# EasyEDA Pro project U100.eprj

# Schematic Schematic1
Create Date: 2022-11-19; Page Name: P1; Project Name: U100; Schematic Name: Schematic1; Company: 嘉立创EDA; Page Size: A4; Version: V1.0
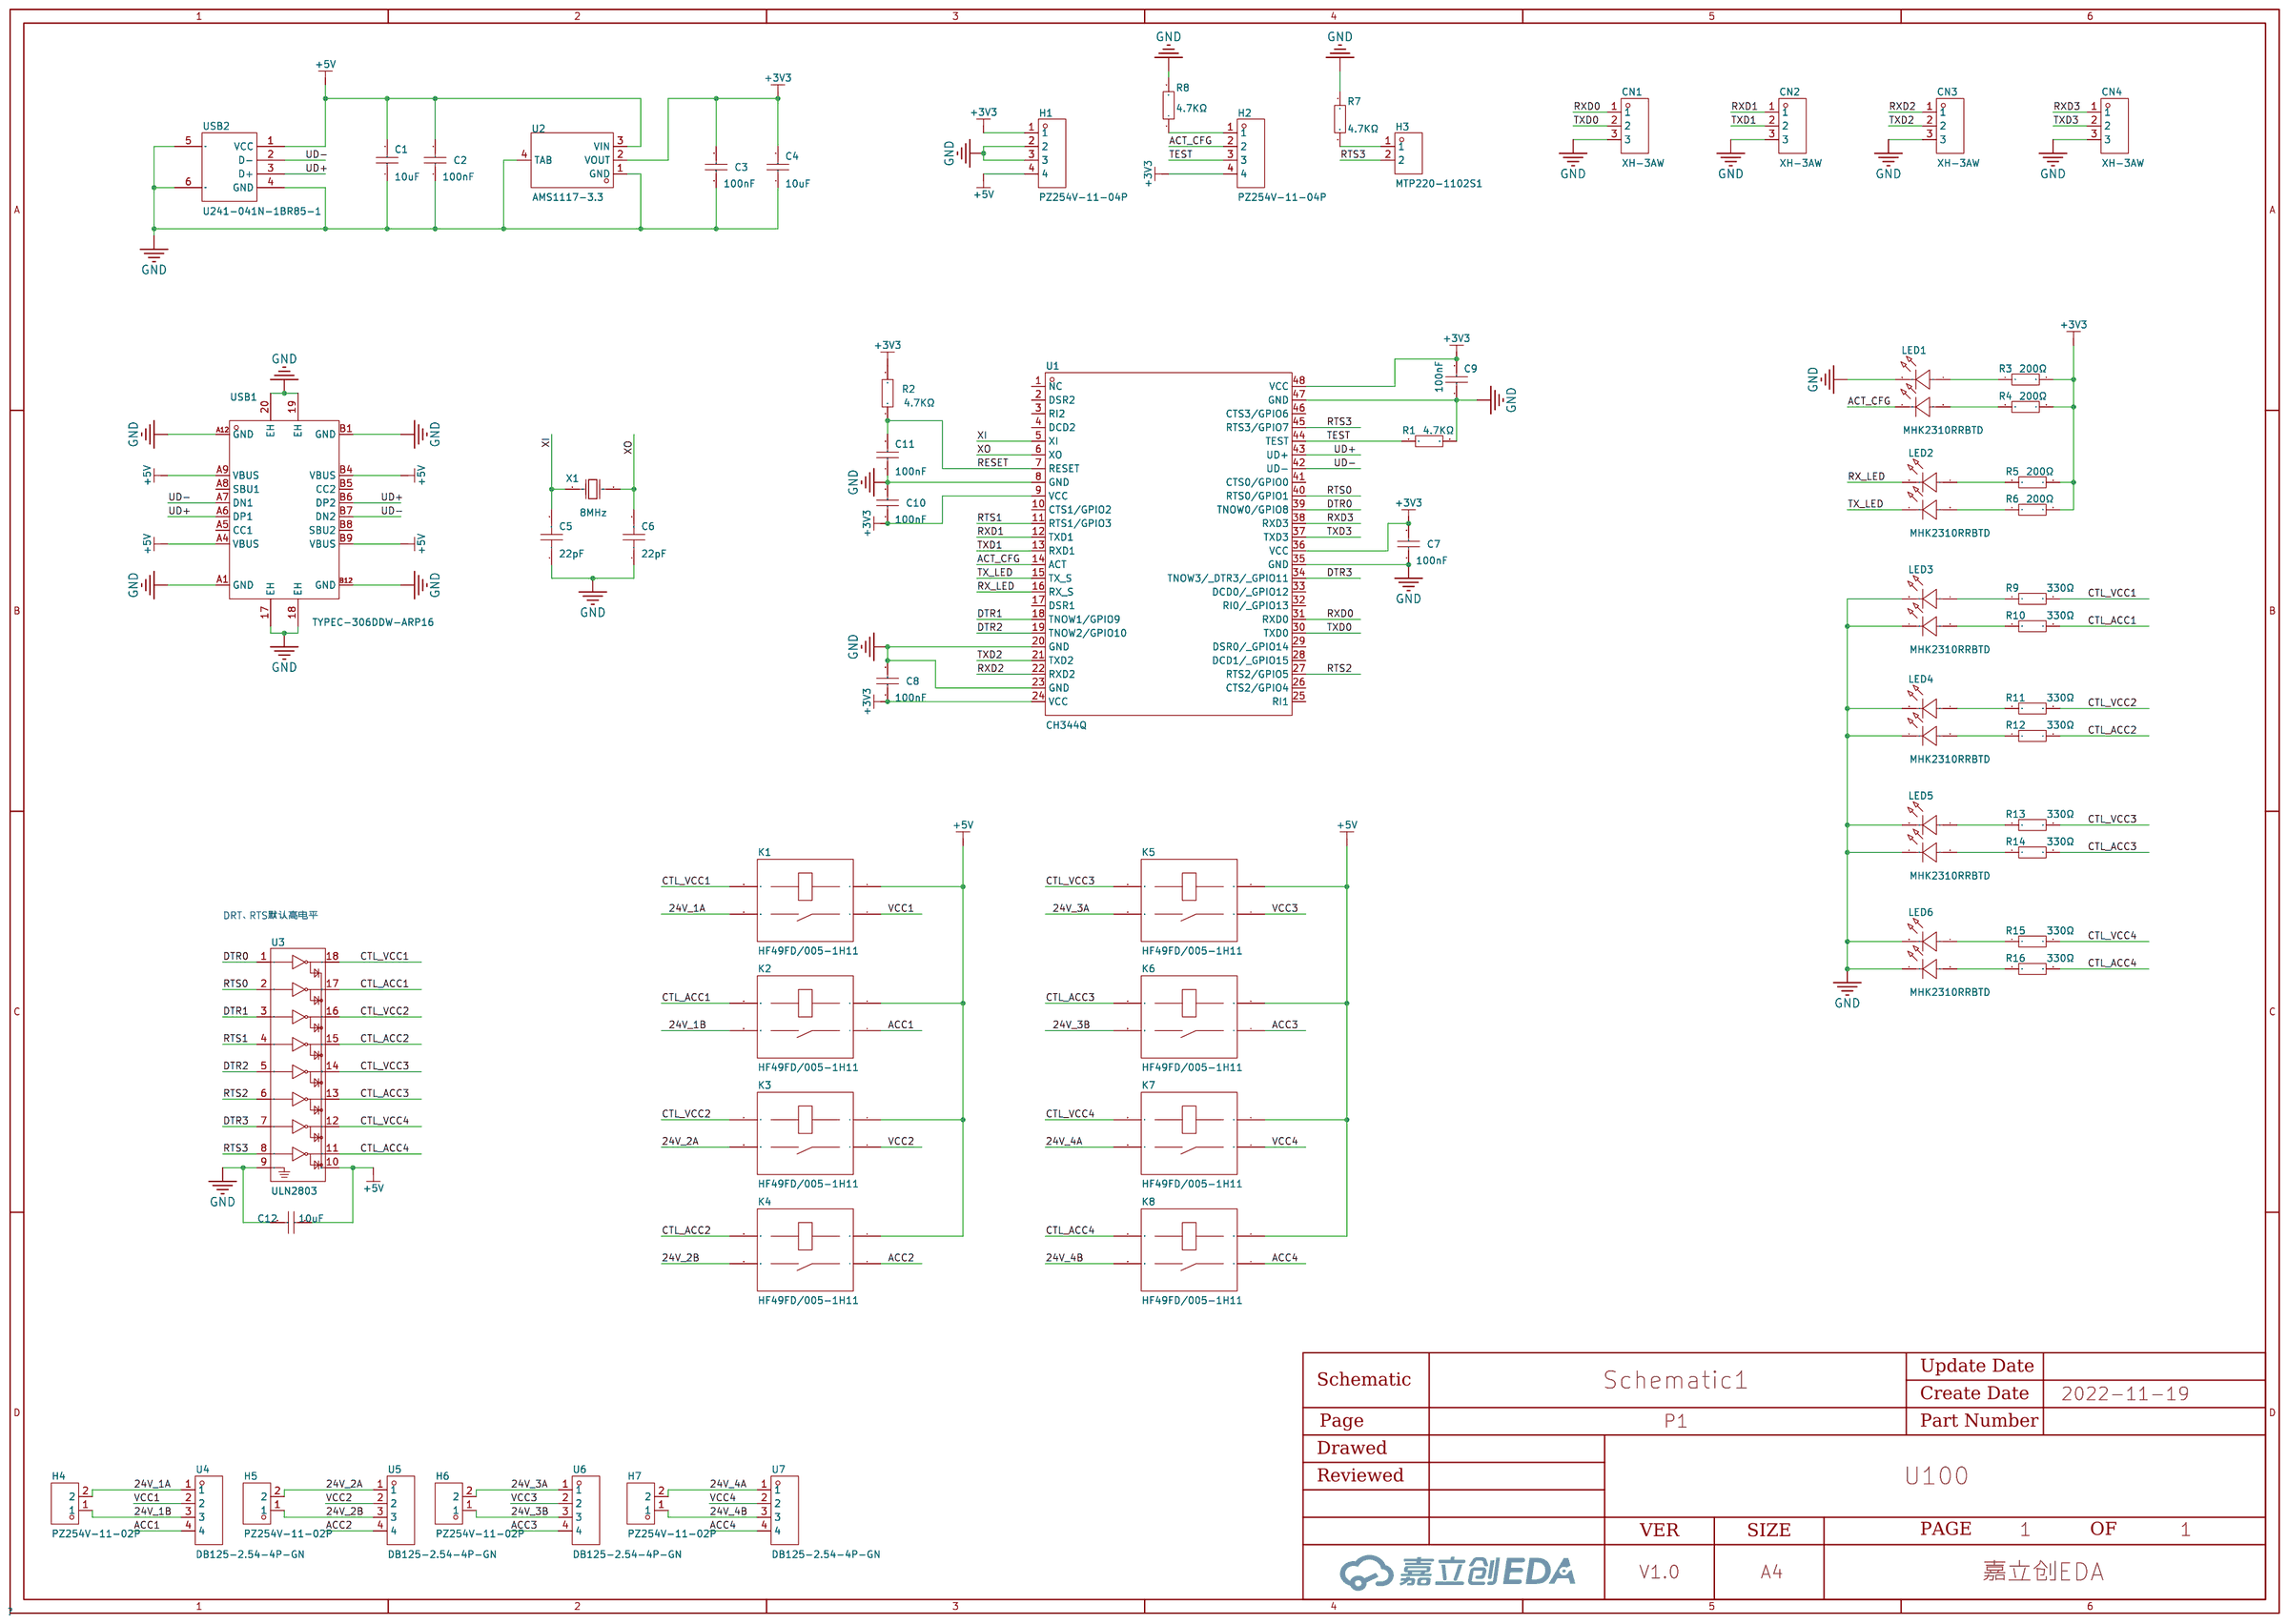
[diagram p0: schematic sheet]

## Parts
C1  10uF  [C0805]
C2  100nF  [C0805]
C3  100nF  [C0805]
C4  10uF  [C0805]
C5  22pF  [C0805]
C6  22pF  [C0805]
C7  100nF  [C0805]
C8  100nF  [C0805]
C9  100nF  [C0805]
C10  100nF  [C0805]
C11  100nF  [C0805]
C12  10uF  [C0805]
CN1  XH-3AW  [CONN-TH_3P-P2.54_HCTL_XH-3AW]
CN2  XH-3AW  [CONN-TH_3P-P2.54_HCTL_XH-3AW]
CN3  XH-3AW  [CONN-TH_3P-P2.54_HCTL_XH-3AW]
CN4  XH-3AW  [CONN-TH_3P-P2.54_HCTL_XH-3AW]
H1  PZ254V-11-04P  [HDR-TH_4P-P2.54-V-M]
H2  PZ254V-11-04P  [HDR-TH_4P-P2.54-V-M]
H3  MTP220-1102S1  [HDR-TH_2P-P2.00-V-M]
H4  PZ254V-11-02P  [HDR-TH_2P-P2.54-V-M]
H5  PZ254V-11-02P  [HDR-TH_2P-P2.54-V-M]
H6  PZ254V-11-02P  [HDR-TH_2P-P2.54-V-M]
H7  PZ254V-11-02P  [HDR-TH_2P-P2.54-V-M]
K1  HF49FD/005-1H11  [RELAY-TH_HF49FD-XXX-1H11-XXX]
K2  HF49FD/005-1H11  [RELAY-TH_HF49FD-XXX-1H11-XXX]
K3  HF49FD/005-1H11  [RELAY-TH_HF49FD-XXX-1H11-XXX]
K4  HF49FD/005-1H11  [RELAY-TH_HF49FD-XXX-1H11-XXX]
K5  HF49FD/005-1H11  [RELAY-TH_HF49FD-XXX-1H11-XXX]
K6  HF49FD/005-1H11  [RELAY-TH_HF49FD-XXX-1H11-XXX]
K7  HF49FD/005-1H11  [RELAY-TH_HF49FD-XXX-1H11-XXX]
K8  HF49FD/005-1H11  [RELAY-TH_HF49FD-XXX-1H11-XXX]
LED1  MHK2310RRBTD  [LED-TH_4P-P2.54_MHK2310RRBTD]
LED2  MHK2310RRBTD  [LED-TH_4P-P2.54_MHK2310RRBTD]
LED3  MHK2310RRBTD  [LED-TH_4P-P2.54_MHK2310RRBTD]
LED4  MHK2310RRBTD  [LED-TH_4P-P2.54_MHK2310RRBTD]
LED5  MHK2310RRBTD  [LED-TH_4P-P2.54_MHK2310RRBTD]
LED6  MHK2310RRBTD  [LED-TH_4P-P2.54_MHK2310RRBTD]
R1  4.7KΩ  [R0805]
R2  4.7KΩ  [R0805]
R3  200Ω  [R0805]
R4  200Ω  [R0805]
R5  200Ω  [R0805]
R6  200Ω  [R0805]
R7  4.7KΩ  [R0805]
R8  4.7KΩ  [R0805]
R9  330Ω  [R0805]
R10  330Ω  [R0805]
R11  330Ω  [R0805]
R12  330Ω  [R0805]
R13  330Ω  [R0805]
R14  330Ω  [R0805]
R15  330Ω  [R0805]
R16  330Ω  [R0805]
U1  CH344Q  [LQFP-48_L7.0-W7.0-P0.50-LS9.0-BL]
U2  AMS1117-3.3  [SOT-223-3_L6.5-W3.4-P2.30-LS7.0-BR]
U3  ULN2803  [SOP-18_L11.5-W7.5-P1.27-LS10.3-BL]
U4  DB125-2.54-4P-GN  [CONN-TH_DB125-2.54-4P-GN]
U5  DB125-2.54-4P-GN  [CONN-TH_DB125-2.54-4P-GN]
U6  DB125-2.54-4P-GN  [CONN-TH_DB125-2.54-4P-GN]
U7  DB125-2.54-4P-GN  [CONN-TH_DB125-2.54-4P-GN]
USB1  TYPEC-306DDW-ARP16  [USB-C-TH_TYPEC-306DDW-ARP16]
USB2  U241-041N-1BR85-1  [USB-B-TH_U241-041N-1BR85-1]
X1  8MHz  [OSC-TH_L10.0-W4.5-P5.00]

## Library data of the parts
C1-C4 C7-C12 = 0805B104K500NT: 温度系数:X7R;容值:100nF;精度:±10%;额定电压:50V;; LCSC Part Name: 100nF(104) ±10% 50V; Supplier Part: C38141; Manufacturer: FH(风华); Supplier Footprint: 0805; JLCPCB Part Class: Extended Part; Datasheet: https://atta.szlcsc.com/upload/public/pdf/source/20170923/C38141_1506149447419988747.pdf; Supplier: LCSC; Temperature Coefficient: X7R; Tolerance: ±10%; Voltage Rated: 50V
C5 C6 = 0805CG220J500NT: 温度系数:C0G;精度:±5%;额定电压:50V;容值:22pF;; LCSC Part Name: 22pF(220) ±5% 50V; Supplier Part: C24658; Manufacturer: FH(风华); Supplier Footprint: 0805; JLCPCB Part Class: Extended Part; Datasheet: https://atta.szlcsc.com/upload/public/pdf/source/20170923/C24658_1506149422956988697.pdf; Supplier: LCSC; Temperature Coefficient: C0G; Tolerance: ±5%; Voltage Rated: 50V
CN1-CN4 = XH-3AW: 参考系列:XH;间距:2.54mm;插针结构:1x3P;排数:1;每排PIN数:3;行距:-;公母:公型插针;安装方式:弯插;额定电流:3A;工作温度范围:-25℃~+85℃;; LCSC Part Name: 3P 2.54mm; Supplier Part: C2908612; Manufacturer: HCTL(华灿天禄); Supplier Footprint: 插件,P=2.54mm; JLCPCB Part Class: Extended Part; Datasheet: https://atta.szlcsc.com/upload/public/pdf/source/20211021/ACA2D54D99493880102FCACAC8DAABA8.pdf; Supplier: LCSC; Reference Series: XH; Pitch: 2.54mm; Pins Structure: 1x3P; Number of Rows: 1; Number of PINs Per Row: 3; Gender: 公型插针; Mounting Style: 弯插; Current Rating (Max): 3A; Operating Temperature Range: -25℃~+85℃
H1 H2 = PZ254V-11-04P: 间距:2.54mm;总PIN位数:4;排数:1;插针结构:1x4P;行距:-;安装类型:直插;圆针/方针:方针;额定电流:3A;额定电压:250V;配合针长度:6mm;塑高:2.5mm;端接针长度:3mm;触头材质:-;工作温度范围:-40℃~+105℃;颜色:黑色;; LCSC Part Name: 2.54mm 1x4P 直插 方针; Supplier Part: C2691448; Manufacturer: XFCN(兴飞); Supplier Footprint: 插件,P=2.54mm; JLCPCB Part Class: Extended Part; Datasheet: https://atta.szlcsc.com/upload/public/pdf/source/20200309/C492403_F9F19131791D08044AD4F84F8E751A34.pdf; Supplier: LCSC; Pitch: 2.54mm; Number of Pins: 4; Number of Rows: 1; Pin Structure: 1x4P; Mounting Type: 直插; Circluar Pins/Square Pins: 方针; Current Rating (Max): 3A; Voltage Rating (Max): 250V; Length of Mating Pin: 6mm; Insulation Height: 2.5mm; Length of End Connection Pin: 3mm; Operating Temperature Range: -40℃~+105℃; Color: 黑色
H3 = MTP220-1102S1: 间距:2mm;总PIN位数:2;排数:1;插针结构:1x2P;行距:-;安装类型:直插;圆针/方针:方针;额定电流:-;额定电压:-;配合针长度:4mm;塑高:2mm;端接针长度:2.8mm;触头材质:黄铜;触头镀层:-;工作温度范围:-40℃~+105℃;颜色:黑色;; LCSC Part Name: 2mm 1x2P 直插 方针; Supplier Part: C376075; Manufacturer: MINTRON(明硕); Supplier Footprint: 插件,P=2mm; JLCPCB Part Class: Extended Part; Datasheet: https://atta.szlcsc.com/upload/public/pdf/source/20190320/C376075_C9D946476DF37AE707CF4A5E7AD237C9.pdf; Supplier: LCSC; Pitch: 2mm; Number of Pins: 2; Number of Rows: 1; Pin Structure: 1x2P; Mounting Type: 直插; Circluar Pins/Square Pins: 方针; Length of Mating Pin: 4mm; Insulation Height: 2mm; Length of End Connection Pin: 2.8mm; Contact Material: 黄铜; Operating Temperature Range: -40℃~+105℃; Color: 黑色
H4-H7 = PZ254V-11-02P: 间距:2.54mm;总PIN位数:2;排数:1;插针结构:1x2P;行距:-;安装类型:直插;圆针/方针:方针;额定电流:-;额定电压:-;配合针长度:6mm;塑高:2.5mm;端接针长度:3mm;触头材质:黄铜;触头镀层:-;工作温度范围:-40℃~+105℃;颜色:黑色;; LCSC Part Name: 2.54mm 1x2P 直插 方针; Supplier Part: C492401; Manufacturer: XFCN(兴飞); Supplier Footprint: 插件,P=2.54mm; JLCPCB Part Class: Extended Part; Datasheet: https://atta.szlcsc.com/upload/public/pdf/source/20200309/C492401_A812433581A9B211A7FFA413ADDFF0E5.pdf; Supplier: LCSC; Pitch: 2.54mm; Number of Pins: 2; Number of Rows: 1; Pin Structure: 1x2P; Mounting Type: 直插; Circluar Pins/Square Pins: 方针; Length of Mating Pin: 6mm; Insulation Height: 2.5mm; Length of End Connection Pin: 3mm; Contact Material: 黄铜; Operating Temperature Range: -40℃~+105℃; Color: 黑色
K1-K8 = HF49FD/005-1H11: 线圈电压:5V;线圈类型:非极化-单线圈;触点形式:一组常开:1A(单刀单掷-常开);最大切换电流:5A;; Supplier Part: C28975; Manufacturer: HF(宏发); Supplier Footprint: SIP-4; JLCPCB Part Class: Extended Part; Datasheet: https://atta.szlcsc.com/upload/public/pdf/source/20141025/1457707244162.pdf; Supplier: LCSC; Coil Voltage: 5V; Coil Type: 非极化-单线圈; Pin Number: 4; Contact Form: 一组常开:1A(单刀单掷-常开); Maximum Switching Current: 5A; Maximum Switching Voltage: 250V@AC；30V@DC; Coil Rated Power: 120mW; Contact Rating: 5A@30VDC；5A@250VAC; Coil Resistance: 208Ω; Operate Time: 10ms; Release Time: 5ms; Contact Resistance: 100mΩ; Contact Material: AgNi; Operating Temperature: -40℃~+85℃
LED1-LED6 = MHK2310RRBTD: 发光颜色:红灯;二极管配置:-;透镜颜色:雾状红;主波长:700nm;峰值波长:-;色温:-;测试电流:20mA;功率:78mW;发光角度:80°;安装方式:-;工作温度:-25℃~+85℃;; LCSC Part Name: 红灯 700nm LED货套双LED; Supplier Part: C2764897; Manufacturer: MEIHUA(美华); Supplier Footprint: 直插,P=2.54mm; JLCPCB Part Class: Extended Part; Datasheet: https://atta.szlcsc.com/upload/public/pdf/source/20220527/CE68B426C791C0435B1D4886CD02D3DC.pdf; Supplier: LCSC; Emitted Color: 红灯; Lens Color: 雾状红; Dominant Wavelength: 700nm; Forward Current: 20mA; Power Dissipation: 78mW; Viewing Angle: 80°; Operating Temperature: -25℃~+85℃; Lamp Holder Type: 组装式圆形灯头
R1-R7 R9-R16 = 0805W8F0000T5E: 精度:±1%;温度系数:±800ppm/℃;阻值:0Ω;功率:0.125W;; LCSC Part Name: 0Ω ±1%; Supplier Part: C17477; Manufacturer: UNI-ROYAL(厚声); Supplier Footprint: 0805; JLCPCB Part Class: Basic Part; Datasheet: https://atta.szlcsc.com/upload/public/pdf/source/20170920/C17477_1505887096936979836.pdf; Supplier: LCSC; Tolerance: ±1%; Temperature Coefficient: ±800ppm/℃; Power(Watts): 0.125W
R8 = 0805W8F0000T5E: 精度:±1%;温度系数:±800ppm/℃;阻值:0Ω;功率:0.125W;; LCSC Part Name: 4.7KΩ ±1%; Supplier Part: C17477; Manufacturer: UNI-ROYAL(厚声); Supplier Footprint: 0805; JLCPCB Part Class: Basic Part; Datasheet: https://atta.szlcsc.com/upload/public/pdf/source/20170920/C17477_1505887096936979836.pdf; Supplier: LCSC; Tolerance: ±1%; Temperature Coefficient: ±800ppm/℃; Power(Watts): 0.125W
U1 = CH344Q: USB转四路异步串口,波特率支持高达230400bps,提供4路RS485方向控制引脚,12GPIO等信号; Supplier Part: C2988084; Manufacturer: WCH(南京沁恒); Supplier Footprint: LQFP-48; JLCPCB Part Class: Extended Part; Datasheet: https://atta.szlcsc.com/upload/public/pdf/source/20220418/AB154A0A58B20703C58BC5378F7BDD74.pdf; Supplier: LCSC
U2 = AMS1117-3.3_C351784: 输出类型:固定;输出极性:正;输出通道数:1;最大输入电压:18V;输出电压:3.3V;压差:1.4V@(1A);输出电流:800mA;电源纹波抑制比(PRSS):-;; LCSC Part Name: Vin=18V Vout=3.3V 800mA; Supplier Part: C351784; Manufacturer: PUOLOP(迪浦); Supplier Footprint: SOT-223; JLCPCB Part Class: Extended Part; Datasheet: https://atta.szlcsc.com/upload/public/pdf/source/20210915/EA806799CEEC3F52E0A4FA8303A508AC.pdf; Supplier: LCSC; Output Type: 固定; Output Polarity: 正; Number of Outputs: 1; Maximum Input Voltage: 18V; Output Voltage: 3.3V; Dropout Voltage: 1.4V@(1A); Output Current: 800mA
U3 = ULN2803_C504564: 开态输入电压(VI(on)@Vce,Ic):3V@2V,300mA;集射极饱和压降(VCE(sat)@Ii,Ic):0.85V@250A,100mA;输出漏电流(Icex@Vce):50A@40V;开态输入电流(Ii@Vi):0.93mA@3.85V;关态输入电流(Ii(off)@Vce,Ic):100A@500mA;嵌位二极管漏电流(IR@VR):50A@40V;嵌位二极管正向压降(VF@IF):1.5V@350mA;输入电容(Ci):15pF;工作温度:0℃~+70℃;; Supplier Part: C504564; Manufacturer: Gcore(扬州国芯); Supplier Footprint: SOP-18; JLCPCB Part Class: Extended Part; Datasheet: https://atta.szlcsc.com/upload/public/pdf/source/20200327/C504564_30BE622D4B2BD79BF189CC2BD56DB9B3.pdf; Supplier: LCSC; ON-state input   voltage(VI(on)@Vce,Ic): 3V@2V,300mA; Collector-emitter   saturation voltage (VCE(sat)@Ii,Ic): 0.85V@250A,100mA; Output leakage current (Icex@Vce): 50A@40V; Input current (Ii@Vi): 0.93mA@3.85V; Off-state input current (Ii(off)@Vce,Ic): 100A@500mA; Clamp Diode Leakage Current (IR@VR): 50A@40V; Clamp Diode Forward Voltage (VF@IF): 1.5V@350mA; Input Capacitance (Ci): 15pF; Operating Temperature: 0℃~+70℃
U4-U7 = DB125-2.54-4P-GN: 间距:2.54mm;排数:1;每排PIN数:4;安装方式:直针;额定电流:8A;额定电压:130V;线规 - AWG:18~26;线规 - mm²:0.5~1;工作温度范围:-40℃~+105℃;颜色:绿色;; LCSC Part Name: 2.54mm 排数:1 每排P数:4 直针; Supplier Part: C918122; Manufacturer: DIBO(地博电气); Supplier Footprint: 直插,P=2.54mm; JLCPCB Part Class: Extended Part; Datasheet: https://atta.szlcsc.com/upload/public/pdf/source/20201111/C918120_C9DB7F6F3DB366529A80D61CABEEDAE6.pdf; Supplier: LCSC; Pitch: 2.54mm; Number of Rows: 1; Number of PINs Per Row: 4; Mounting Style: 直针; Current Rating (Max): 8A; Voltage Rating (Max): 130V; Wire Gauge - AWG: 18~26; Wire Gauge - mm?: 0.5~1; Operating Temperature Range: -40℃~+105℃; Color: 绿色
USB1 = TYPEC-306DDW-ARP16: 连接器类型:Type-C;标准:USB 3.1;公母:母座;触点数量:16;端口数量:1;安装方式:弯插;额定电流 - 电源:5A;触头材质:-;触头镀层:-;工作温度范围:-45℃~+85℃;焊接温度(最大值):260℃;; LCSC Part Name: Type-C 母座 弯插; Supplier Part: C2840393; Manufacturer: XUNPU(讯普); Supplier Footprint: 插件; JLCPCB Part Class: Extended Part; Datasheet: https://atta.szlcsc.com/upload/public/pdf/source/20210817/197D5097245422051F6928F5184DB483.pdf; Supplier: LCSC; Connector Type: Type-C; Standard: USB 3.1; Gender: 母座; Number of Contacts: 16; Number of Ports: 1; Mounting Style: 弯插; Current Rating - Power (Max): 5A; Operating Temperature Range: -45℃~+85℃; Welding Temperature (Max): 260℃
USB2 = U241-041N-1BR85-1: 连接器类型:Type-B;标准:USB 2.0;公母:母座;触点数量:4;端口数量:1;安装方式:弯插;额定电流 - 电源:2A;触头材质:黄铜;触头镀层:金;工作温度范围:-40℃~+85℃;焊接温度(最大值):235℃;; LCSC Part Name: Type-B 母座 弯插; Supplier Part: C397338; Manufacturer: XKB Connectivity(中国星坤); Supplier Footprint: 插件; JLCPCB Part Class: Extended Part; Datasheet: https://atta.szlcsc.com/upload/public/pdf/source/20211011/96CE344EA33EF85845E438A5758B100B.pdf; Supplier: LCSC; Connector Type: Type-B; Standard: USB 2.0; Gender: 母座; Number of Contacts: 4; Number of Ports: 1; Mounting Style: 弯插; Current Rating - Power (Max): 2A; Contact Material: 黄铜; Contact Plating: 金; Operating Temperature Range: -40℃~+85℃; Welding Temperature (Max): 235℃
X1 = X49SD8MSD2SC: 晶振类型:49S晶振;频率:8MHz;频率公差:±20ppm;频率稳定度:±30ppm;负载电容:20pF;工作温度:-20℃~+70℃;; LCSC Part Name: HC-49US 8MHz ±20ppm 20pF; Supplier Part: C21263; Manufacturer: YXC(扬兴晶振); Supplier Footprint: HC-49S-2P; JLCPCB Part Class: Extended Part; Datasheet: https://atta.szlcsc.com/upload/public/pdf/source/20210903/A997D130AE99CBB55D9024F9BE6DA174.pdf; Supplier: LCSC; Crystal Type: 49S晶振; Frequency Tolerance: ±20ppm; Frequency Stability: ±30ppm; Load Capacitance: 20pF; Operating Temperature: -20℃~+70℃

## Nets
24V_1A: H4.2 K1.3 U4.1
24V_1B: H4.1 K2.3 U4.3
24V_2A: H5.2 K3.3 U5.1
24V_2B: H5.1 K4.3 U5.3
24V_3A: H6.2 K5.3 U6.1
24V_3B: H6.1 K6.3 U6.3
24V_4A: H7.2 K7.3 U7.1
24V_4B: H7.1 K8.3 U7.3
+3V3: C3.2 C4.2 C7.2 C8.1 C9.2 C10.1 H1.1 H2.4 R2.2 R3.2 R4.2 R5.2 R6.2 U1.9(VCC) U1.24(VCC) U1.36(VCC) U1.48(VCC) U2.2(VOUT)
+5V: C1.2 C2.2 C12.1 H1.4 K1.1 K2.1 K3.1 K4.1 K5.1 K6.1 K7.1 K8.1 U2.3(VIN) U3.10(COMMON) USB1.A4(VBUS) USB1.A9(VBUS) USB1.B4(VBUS) USB1.B9(VBUS) USB2.1(VCC)
GND: C1.1 C2.1 C3.1 C4.1 C5.1 C6.1 C7.1 C8.2 C9.1 C10.2 C11.1 C12.2 CN1.3 CN2.3 CN3.3 CN4.3 H1.2 H1.3 LED1.3(K) LED3.1(K) LED3.3(K) LED4.1(K) LED4.3(K) LED5.1(K) LED5.3(K) LED6.1(K) LED6.3(K) R1.2 R7.1 R8.2 U1.8(GND) U1.20(GND) U1.23(GND) U1.35(GND) U1.47(GND) U2.1(GND) U2.4(TAB) U3.9(GND) USB1.17(EH) USB1.18(EH) USB1.19(EH) USB1.20(EH) USB1.A1(GND) USB1.A12(GND) USB1.B1(GND) USB1.B12(GND) USB2.4(GND) USB2.5(SH1) USB2.6(SH2)
VCC1: K1.4 U4.2
VCC2: K3.4 U5.2
VCC3: K5.4 U6.2
VCC4: K7.4 U7.2
ACC1: K2.4 U4.4
ACC2: K4.4 U5.4
ACC3: K6.4 U6.4
ACC4: K8.4 U7.4
ACT_CFG: H2.2 LED1.1(K) U1.14(ACT)
CTL_ACC1: K2.2 R10.2 U3.17(O2)
CTL_ACC2: K4.2 R12.2 U3.15(O4)
CTL_ACC3: K6.2 R14.2 U3.13(O6)
CTL_ACC4: K8.2 R16.2 U3.11(O8)
CTL_VCC1: K1.2 R9.2 U3.18(O1)
CTL_VCC2: K3.2 R11.2 U3.16(O3)
CTL_VCC3: K5.2 R13.2 U3.14(O5)
CTL_VCC4: K7.2 R15.2 U3.12(O7)
DTR0: U1.39(TNOW0/GPIO8) U3.1(I1)
DTR1: U1.18(TNOW1/GPIO9) U3.3(I3)
DTR2: U1.19(TNOW2/GPIO10) U3.5(I5)
DTR3: U1.34(TNOW3/ DTR3/ GPIO11) U3.7(I7)
RESET: C11.2 R2.1 U1.7(RESET)
RTS0: U1.40(RTS0/GPIO1) U3.2(I2)
RTS1: U1.11(RTS1/GPIO3) U3.4(I4)
RTS2: U1.27(RTS2/GPIO5) U3.6(I6)
RTS3: H3.2 U1.45(RTS3/GPIO7) U3.8(I8)
RX_LED: LED2.3(K) U1.16(RX_S)
RXD0: CN1.1 U1.31(RXD0)
RXD1: CN2.1 U1.12(TXD1)
RXD2: CN3.1 U1.22(RXD2)
RXD3: CN4.1 U1.38(RXD3)
TEST: H2.3 R1.1 U1.44(TEST)
TX_LED: LED2.1(K) U1.15(TX_S)
TXD0: CN1.2 U1.30(TXD0)
TXD1: CN2.2 U1.13(RXD1)
TXD2: CN3.2 U1.21(TXD2)
TXD3: CN4.2 U1.37(TXD3)
UD+: U1.43(UD+) USB1.A6(DP1) USB1.B6(DP2) USB2.3(D+)
UD-: U1.42(UD-) USB1.A7(DN1) USB1.B7(DN2) USB2.2(D-)
XI: C5.2 U1.5(XI) X1.1(OSC1)
XO: C6.2 U1.6(XO) X1.2(OSC2)
$1N13413: LED1.4(A) R3.1
$1N13442: LED1.2(A) R4.1
$1N14121: LED2.4(A) R5.1
$1N14153: LED2.2(A) R6.1
$1N14923: H2.1 R8.1
$1N15051: H3.1 R7.2
$1N34229: LED3.4(A) R9.1
$1N34270: LED3.2(A) R10.1
$1N34311: LED4.4(A) R11.1
$1N34352: LED4.2(A) R12.1
$1N34393: LED5.4(A) R13.1
$1N34434: LED5.2(A) R14.1
$1N34475: LED6.4(A) R15.1
$1N34516: LED6.2(A) R16.1

Not connected (* = marked no-connect by the designer): U1 1(NC) 2(DSR2) 3(RI2) 4(DCD2) 10(CTS1/GPIO2) 17(DSR1) 25(RI1) 26(CTS2/GPIO4) 28(DCD1/ GPIO15) 29(DSR0/ GPIO14) 32(RI0/ GPIO13) 33(DCD0/ GPIO12) 41(CTS0/GPIO0) 46(CTS3/GPIO6); USB1 A5(CC1) A8(SBU1) B5(CC2) B8(SBU2)

## Notes on the sheet
- DRT、RTS默认高电平

# Board PCB1
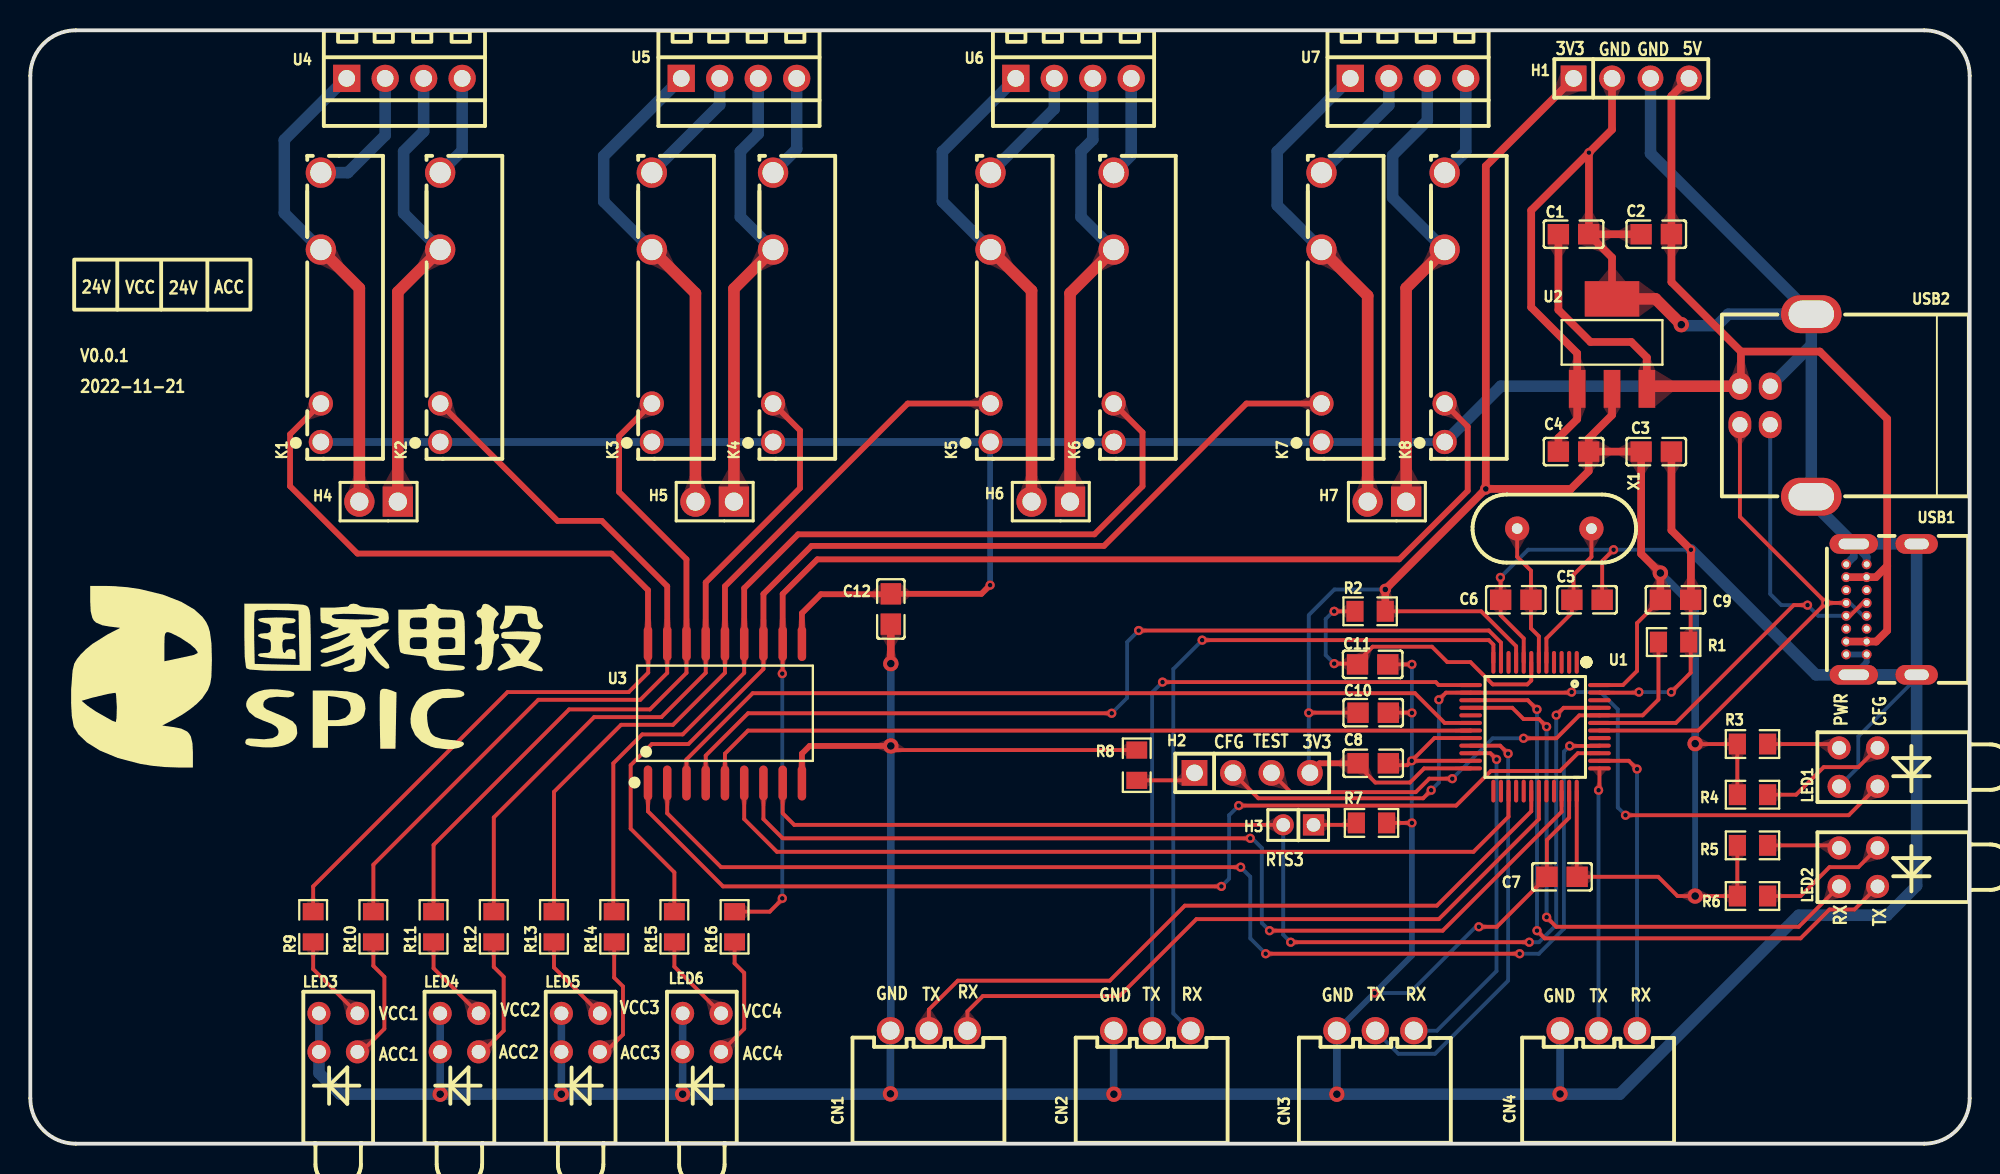
[diagram p1: board, top side]
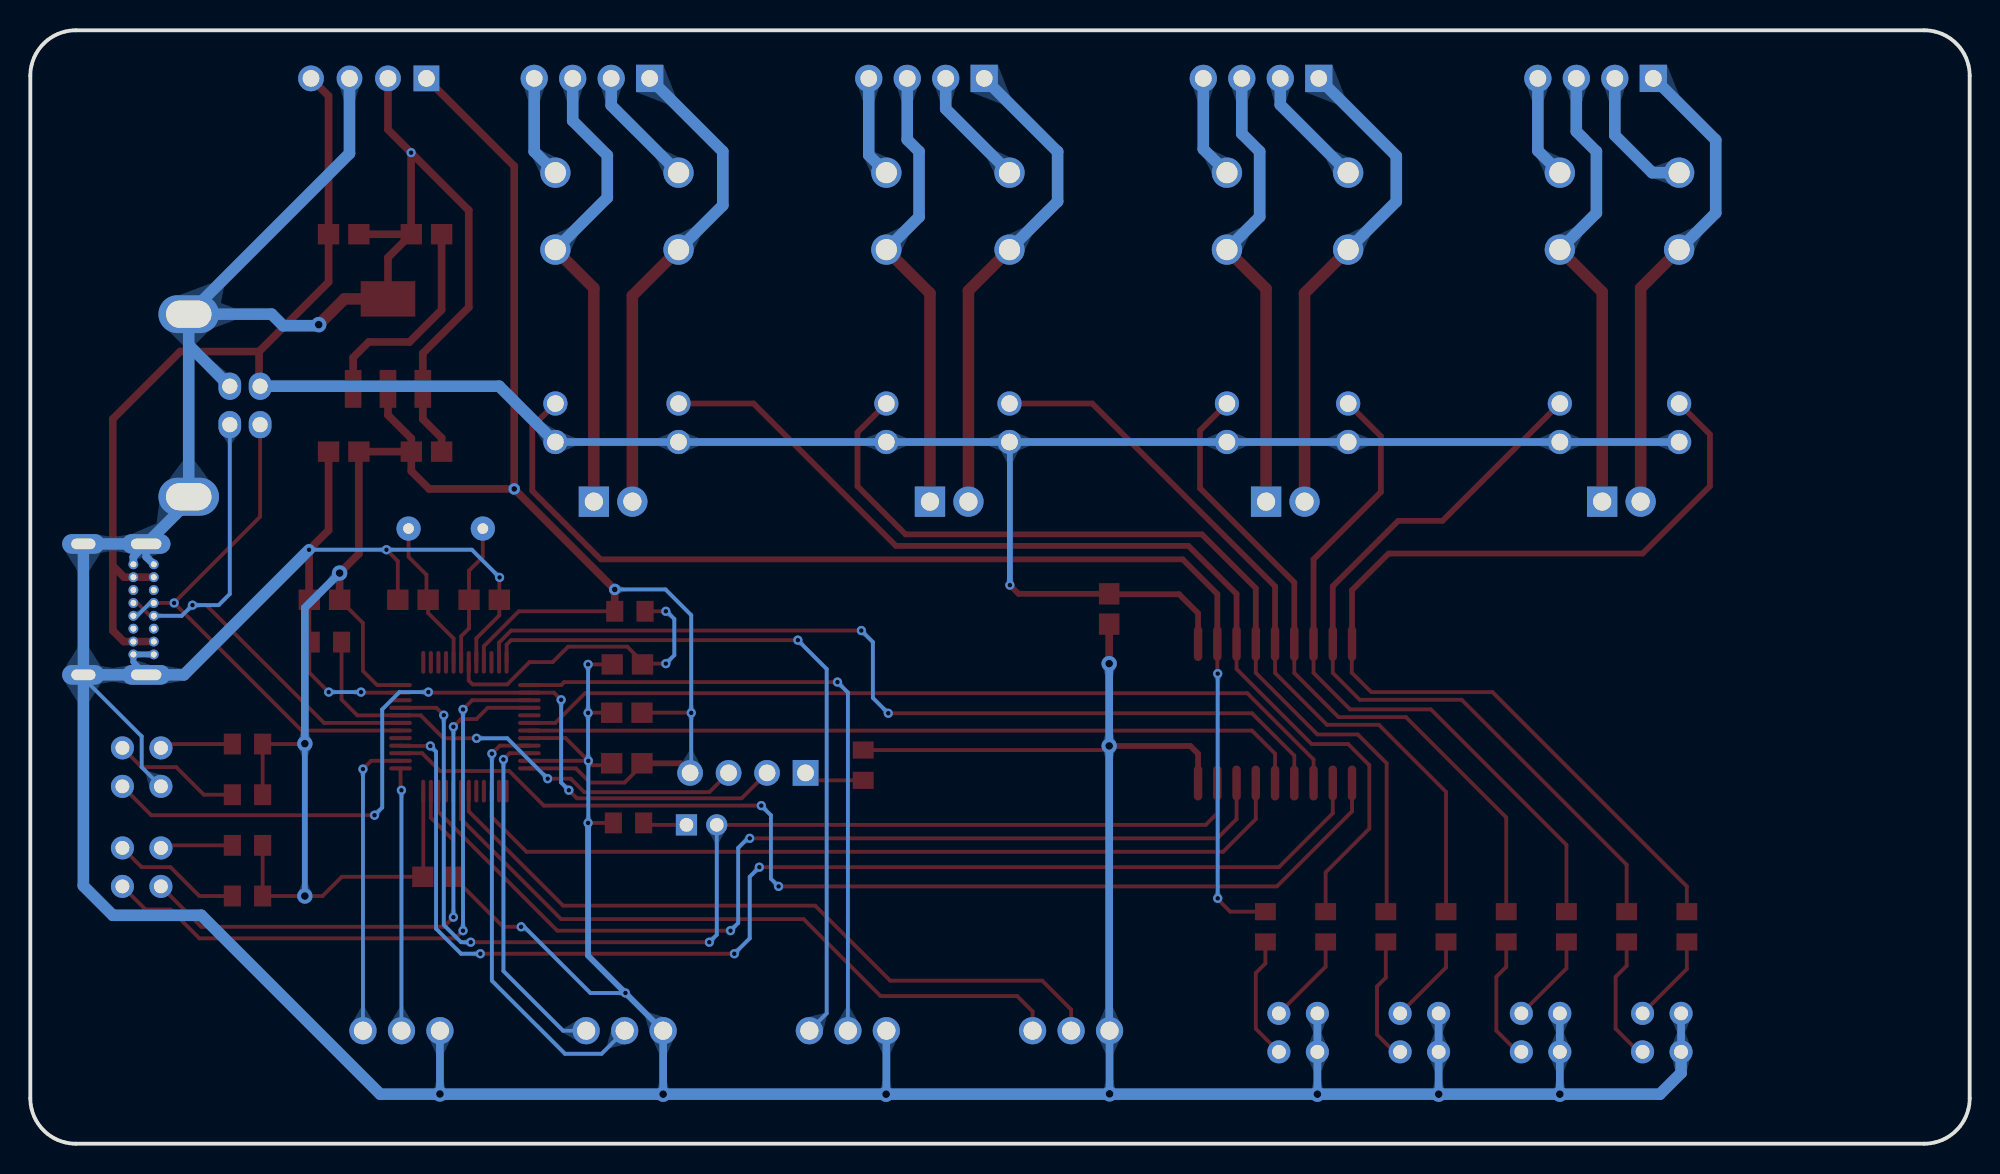
[diagram p2: board, bottom side, seen from below]

Outline 128 x 73.5 mm; copper layers: Top Layer, Bottom Layer. Coordinates in mm from the lower left corner of the outline.
Outline path: 0,70.5 0,3 arc(0.88,0.88) 3,0 125,0 arc(127.12,0.88) 128,3 128,70.5 arc(127.12,72.62) 125,73.5 3,73.5 arc(0.88,72.62) 0,70.5
Stack: Top Layer 0.035mm / Dielectric1 1.51mm FR4 er 4.5 / Bottom Layer 0.035mm

## Design rules (mm)
net UD+: DP1
net UD-: DP1
spacing safeClearance (default): track to track 0.152, other pairs 0.152 to 0.3
track width trackWidth (default): min 0.127, default 0.254, max 2.54
differential pair differentialPair (default): width min 0.127, default 0.254, max 2.54; gap min 0.152, default 0.152
via viaSize (default): diameter min 0.5, default 0.61, max 10; hole min 0.3, default 0.305, max 6

## Placement (name value [footprint] x y rotation side)
C1  10uF  [C0805]  101.85 60.04 180 top
C2  100nF  [C0805]  107.31 60.04 0 top
C3  100nF  [C0805]  107.31 45.69 180 top
C4  10uF  [C0805]  101.85 45.69 0 top
C5  22pF  [C0805]  102.74 35.91 180 top
C6  22pF  [C0805]  98.04 35.91 0 top
C7  100nF  [C0805]  101.09 17.62 0 top
C8  100nF  [C0805]  88.63 25.11 0 top
C9  100nF  [C0805]  108.59 35.91 180 top
C10  100nF  [C0805]  88.63 28.45 0 top
C11  100nF  [C0805]  88.59 31.64 180 top
C12  10uF  [C0805]  56.79 35.3 270 top
CN1  XH-3AW  [CONN-TH_3P-P2.54_HCTL_XH-3AW]  59.31 7.46 180 top
CN2  XH-3AW  [CONN-TH_3P-P2.54_HCTL_XH-3AW]  74.04 7.46 180 top
CN3  XH-3AW  [CONN-TH_3P-P2.54_HCTL_XH-3AW]  88.77 7.46 180 top
CN4  XH-3AW  [CONN-TH_3P-P2.54_HCTL_XH-3AW]  103.5 7.46 180 top
H1  PZ254V-11-04P  [HDR-TH_4P-P2.54-V-M]  105.66 70.33 0 top
H2  PZ254V-11-04P  [HDR-TH_4P-P2.54-V-M]  80.65 24.48 0 top
H3  MTP220-1102S1  [HDR-TH_2P-P2.00-V-M]  83.69 21.05 180 top
H4  PZ254V-11-02P  [HDR-TH_2P-P2.54-V-M]  22.99 42.39 180 top
H5  PZ254V-11-02P  [HDR-TH_2P-P2.54-V-M]  45.17 42.39 180 top
H6  PZ254V-11-02P  [HDR-TH_2P-P2.54-V-M]  67.35 42.39 180 top
H7  PZ254V-11-02P  [HDR-TH_2P-P2.54-V-M]  89.53 42.39 180 top
K1  HF49FD/005-1H11  [RELAY-TH_HF49FD-XXX-1H11-XXX]  19.18 55.21 90 top
K2  HF49FD/005-1H11  [RELAY-TH_HF49FD-XXX-1H11-XXX]  27.05 55.21 90 top
K3  HF49FD/005-1H11  [RELAY-TH_HF49FD-XXX-1H11-XXX]  41.02 55.21 90 top
K4  HF49FD/005-1H11  [RELAY-TH_HF49FD-XXX-1H11-XXX]  49.02 55.21 90 top
K5  HF49FD/005-1H11  [RELAY-TH_HF49FD-XXX-1H11-XXX]  63.37 55.21 90 top
K6  HF49FD/005-1H11  [RELAY-TH_HF49FD-XXX-1H11-XXX]  71.5 55.21 90 top
K7  HF49FD/005-1H11  [RELAY-TH_HF49FD-XXX-1H11-XXX]  85.22 55.21 90 top
K8  HF49FD/005-1H11  [RELAY-TH_HF49FD-XXX-1H11-XXX]  93.34 55.21 90 top
LED1  MHK2310RRBTD  [LED-TH_4P-P2.54_MHK2310RRBTD]  120.65 24.86 90 top
LED2  MHK2310RRBTD  [LED-TH_4P-P2.54_MHK2310RRBTD]  120.65 18.25 90 top
LED3  MHK2310RRBTD  [LED-TH_4P-P2.54_MHK2310RRBTD]  20.32 7.33 0 top
LED4  MHK2310RRBTD  [LED-TH_4P-P2.54_MHK2310RRBTD]  28.32 7.33 0 top
LED5  MHK2310RRBTD  [LED-TH_4P-P2.54_MHK2310RRBTD]  36.32 7.33 0 top
LED6  MHK2310RRBTD  [LED-TH_4P-P2.54_MHK2310RRBTD]  44.32 7.33 0 top
R1  4.7KΩ  [R0805]  108.46 33.11 0 top
R2  4.7KΩ  [R0805]  88.43 35.15 0 top
R3  200Ω  [R0805]  113.66 26.38 180 top
R4  200Ω  [R0805]  113.66 23.04 180 top
R5  200Ω  [R0805]  113.66 19.69 180 top
R6  200Ω  [R0805]  113.66 16.35 180 top
R7  4.7KΩ  [R0805]  88.52 21.18 180 top
R8  4.7KΩ  [R0805]  73.03 24.99 90 top
R9  330Ω  [R0805]  18.67 14.32 90 top
R10  330Ω  [R0805]  22.64 14.32 90 top
R11  330Ω  [R0805]  26.62 14.32 90 top
R12  330Ω  [R0805]  30.59 14.32 90 top
R13  330Ω  [R0805]  34.56 14.32 90 top
R14  330Ω  [R0805]  38.54 14.32 90 top
R15  330Ω  [R0805]  42.51 14.32 90 top
R16  330Ω  [R0805]  46.48 14.32 90 top
U1  CH344Q  [LQFP-48_L7.0-W7.0-P0.50-LS9.0-BL]  99.31 27.53 180 top
U2  AMS1117-3.3  [SOT-223-3_L6.5-W3.4-P2.30-LS7.0-BR]  104.39 52.8 270 top
U3  ULN2803  [SOP-18_L11.5-W7.5-P1.27-LS10.3-BL]  45.85 28.42 0 top
U4  DB125-2.54-4P-GN  [CONN-TH_DB125-2.54-4P-GN]  24.69 70.33 0 top
U5  DB125-2.54-4P-GN  [CONN-TH_DB125-2.54-4P-GN]  46.77 70.33 0 top
U6  DB125-2.54-4P-GN  [CONN-TH_DB125-2.54-4P-GN]  68.85 70.33 0 top
U7  DB125-2.54-4P-GN  [CONN-TH_DB125-2.54-4P-GN]  90.93 70.33 0 top
USB1  TYPEC-306DDW-ARP16  [USB-C-TH_TYPEC-306DDW-ARP16]  122.17 35.27 90 top
USB2  U241-041N-1BR85-1  [USB-B-TH_U241-041N-1BR85-1]  115.19 48.73 90 top
X1  8MHz  [OSC-TH_L10.0-W4.5-P5.00]  100.58 40.61 270 top

## Footprints (pads in the part's own frame, mm; a bottom-side part is the same pattern mirrored in y, then rotated)
C0805
  rect 1.41x1.35 smd: 1(-1,0) 2(1,0)
CONN-TH_3P-P2.54_HCTL_XH-3AW
  round 1.801 hole 1.199: 1(-2.54,0) 2(0.003,0) 3(2.54,0)
CONN-TH_DB125-2.54-4P-GN
  rect 1.801x1.801 hole 1.1: 1(-3.81,0)
  round 1.801 hole 1.1: 2(-1.27,0) 3(1.27,0) 4(3.81,0)
HDR-TH_2P-P2.00-V-M
  rect 1.4x1.4 hole 0.9: 1(-1,0)
  round 1.4 hole 0.9: 2(1,0)
HDR-TH_2P-P2.54-V-M
  rect 2x2 hole 1.2: 1(-1.27,0)
  round 2 hole 1.2: 2(1.27,0)
HDR-TH_4P-P2.54-V-M
  rect 1.7x1.7 hole 1.1: 1(-3.81,0)
  round 1.7 hole 1.1: 2(-1.27,0) 3(1.27,0) 4(3.81,0)
LED-TH_4P-P2.54_MHK2310RRBTD
  round 1.524 hole 0.914: 1(-1.27,-1.27) 2(1.27,-1.27) 3(-1.27,1.27) 4(1.27,1.27)
LQFP-48_L7.0-W7.0-P0.50-LS9.0-BL
  oval 0.27x1.5 smd: 1(-2.75,-4.25) 2(-2.25,-4.25) 3(-1.75,-4.25) 4(-1.25,-4.25) 5(-0.75,-4.25) 6(-0.25,-4.25) 7(0.25,-4.25) 8(0.75,-4.25) 9(1.25,-4.25) 10(1.75,-4.25) 11(2.25,-4.25) 12(2.75,-4.25) 25(2.75,4.25) 26(2.25,4.25) 27(1.75,4.25) 28(1.25,4.25) 29(0.75,4.25) 30(0.25,4.25) 31(-0.25,4.25) 32(-0.75,4.25) 33(-1.25,4.25) 34(-1.75,4.25) 35(-2.25,4.25) 36(-2.75,4.25)
  oval 1.5x0.27 smd: 13(4.25,-2.75) 14(4.25,-2.25) 15(4.25,-1.75) 16(4.25,-1.25) 17(4.25,-0.75) 18(4.25,-0.25) 19(4.25,0.25) 20(4.25,0.75) 21(4.25,1.25) 22(4.25,1.75) 23(4.25,2.25) 24(4.25,2.75) 37(-4.25,2.75) 38(-4.25,2.25) 39(-4.25,1.75) 40(-4.25,1.25) 41(-4.25,0.75) 42(-4.25,0.25) 43(-4.25,-0.25) 44(-4.25,-0.75) 45(-4.25,-1.25) 46(-4.25,-1.75) 47(-4.25,-2.25) 48(-4.25,-2.75)
OSC-TH_L10.0-W4.5-P5.00
  round 1.6 hole 0.701: 1(0,2.451) 2(0,-2.451)
R0805
  rect 1.133x1.377 smd: 1(-1,0) 2(1,0)
RELAY-TH_HF49FD-XXX-1H11-XXX
  round 1.6 hole 1.1: 1(-8.89,0) 2(-6.35,0)
  round 2 hole 1.4: 3(3.81,0) 4(8.89,0)
SOP-18_L11.5-W7.5-P1.27-LS10.3-BL
  oval 0.559x2.309 smd: 1(-5.08,-4.605) 2(-3.81,-4.605) 3(-2.54,-4.605) 4(-1.27,-4.605) 5(0,-4.605) 6(1.27,-4.605) 7(2.54,-4.605) 8(3.81,-4.605) 9(5.08,-4.605) 10(5.08,4.605) 11(3.81,4.605) 12(2.54,4.605) 13(1.27,4.605) 14(0,4.605) 15(-1.27,4.605) 16(-2.54,4.605) 17(-3.81,4.605) 18(-5.08,4.605)
SOT-223-3_L6.5-W3.4-P2.30-LS7.0-BR
  rect 2.5x1.1 smd: 1(2.97,-2.3) 2(2.97,0) 3(2.97,2.3)
  rect 2.34x3.6 smd: 4(-2.97,0)
USB-B-TH_U241-041N-1BR85-1
  oval 1.8x1.5 hole 1: 1(1.27,2.355) 2(-1.27,2.355) 3(-1.27,0.355) 4(1.27,0.355)
  oval 2.5x4 hole 1.8x3: 5(6.025,-2.355) 6(-6.025,-2.355)
USB-C-TH_TYPEC-306DDW-ARP16
  oval 1.3x3.2 hole 0.701x1.999: 17(4.321,1.823) 20(-4.321,1.823)
  oval 1.3x2.799 hole 0.701x1.6: 18(4.321,-2.324) 19(-4.321,-2.324)
  round 0.65 hole 0.399: A1(-2.974,2.324) A4(-2.126,2.324) A5(-1.275,2.324) A6(-0.424,2.324) A7(0.424,2.324) A8(1.275,2.324) A9(2.126,2.324) A12(2.974,2.324) B1(2.974,0.976) B4(2.126,0.976) B5(1.275,0.976) B6(0.424,0.976) B7(-0.424,0.976) B8(-1.275,0.976) B9(-2.126,0.976) B12(-2.974,0.976)

## Nets
As in the schematic.

Pads without a net: U1 1 2 3 4 10 17 25 26 28 29 32 33 41 46; USB1 A5 A8 B5 B8

## Via types
v1: diameter 0.61, hole 0.305, Top Layer to Bottom Layer, 51 vias
v2: diameter 1.016, hole 0.508, Top Layer to Bottom Layer, 13 vias
v3: diameter 0.762, hole 0.381, Top Layer to Bottom Layer, 2 vias

## Routing (per net, layer and track width the routed paths; a pad name or vN(x,y) marks a point on that pad's centre or on a via; arc(x,y) is an arc through that point)
24V_1A: length 31.7
  Top Layer w0.762: H4.2 21.72,56.48 K1.3
  Bottom Layer w0.762: K1.3 16.76,61.44 16.76,66.26 20.83,70.33 U4.1
24V_1B: length 30.6
  Top Layer w0.762: H4.1 24.26,56.23 K2.3
  Bottom Layer w0.762: K2.3 24.64,61.44 24.64,65.5 25.96,66.82 U4.3
24V_2A: length 32.6
  Top Layer w0.762: H5.2 43.9,56.14 K3.3
  Bottom Layer w0.762: K3.3 37.85,62.2 37.85,65.21 U5.1
24V_2B: length 30.4
  Top Layer w0.762: K4.3 46.44,56.44 H5.1
  Bottom Layer w0.762: U5.3 48.04,66.68 46.86,65.5 46.86,61.18 K4.3
24V_3A: length 32.4
  Top Layer w0.762: K5.3 66.08,56.31 H6.2
  Bottom Layer w0.762: K5.3 60.2,62.2 60.2,65.5 60.22,65.5 U6.1
24V_3B: length 30.3
  Top Layer w0.762: H6.1 68.62,56.14 K6.3
  Bottom Layer w0.762: U6.3 70.12,66.28 69.34,65.5 69.34,61.18 K6.3
24V_4A: length 32.4
  Top Layer w0.762: K7.3 88.26,55.97 H7.2
  Bottom Layer w0.762: U7.1 82.3,65.5 82.3,61.94 K7.3
24V_4B: length 31.4
  Top Layer w0.762: K8.3 90.81,56.48 H7.1
  Bottom Layer w0.762: K8.3 89.92,62.45 89.92,65.25 92.2,67.53 U7.3
+3V3: length 166.1
  Top Layer w0.254: U1.48 105.11,30.28 106.04,31.21 106.04,34.37 C9.2 ; R5.2 R6.2 v2(109.88,16.35) ; 109.91,26.38 R3.2 R4.2 ; U1.24 91.99,24.78 91.06,23.84 88.77,23.84 87.63,24.99 C8.1 ; U1.36 102.06,17.65 C7.2 107.44,17.62 108.71,16.35 109.86,16.35 ; R2.2 95.76,35.15 98.06,32.84 U1.9 ; C10.1 84.39,28.45 v1(84.38,28.44)
  Top Layer w0.381: C8.1 85.09,25.11 H2.4 ; v2(109.88,16.35) 109.86,16.35 ; 109.91,26.38 v2(109.88,26.41)
  Top Layer w0.508: C4.2 102.85,46.56 104.39,48.1 104.39,49.83 ; C4.2 102.85,44.4 101.68,43.22 v3(96.06,43.22) ; C4.2 C3.2 106.31,38.94 v2(107.59,37.67) C9.2 ; v3(96.06,43.22) 96.06,64.53 H1.1 ; v3(96.06,43.22) v3(89.43,36.59) R2.2
  Bottom Layer w0.254: v3(89.43,36.59) 86.07,36.59 84.38,34.89 v1(84.38,28.44) 84.38,24.55 H2.4
  Bottom Layer w0.381: v2(109.88,26.41) v2(109.88,16.35)
  Bottom Layer w0.508: v2(109.88,26.41) 109.88,35.37 v2(107.59,37.67)
+5V: length 194.5
  Top Layer w0.381: U3.10 50.93,35.02 52.18,36.27 56.77,36.27 C12.1 62.77,36.3 v1(63.35,36.87)
  Top Layer w0.508: H1.4 108.31,69.17 C2.2 108.31,56.88 112.9,52.29 ; USB2.1 112.9,50.07 112.9,52.29 ; 106.69,49.83 106.69,51.9 105.66,52.93 102.97,52.93 100.85,55.04 C1.2 ; 112.9,52.29 118.11,52.29 122.56,47.85 122.56,38.14 ; USB1.A9 USB1.B4 121.81,37.4 122.56,38.14 ; 122.56,38.14 122.56,33.87 121.83,33.15 119.85,33.15
  Top Layer w0.762: 106.69,49.83 106.87,50 USB2.1
  Bottom Layer w0.381: K5.1 63.35,46.3 v1(63.35,36.87)
  Bottom Layer w0.508: K1.1 K2.1 K3.1 K4.1 K5.1 K6.1 K7.1 K8.1
  Bottom Layer w0.762: K8.1 93.37,46.32 97.05,50 USB2.1
GND: length 463.6
  Top Layer w0.254: v1(97.03,37.38) 97.04,37.36 C6.1 97.04,34.88 98.56,33.36 U1.8 ; v1(104.5,39.21) 103.74,38.46 C5.1 ; v2(56.79,26.26) 57.07,25.99 R8.2 ; C11.1 v1(91.19,31.64) ; U1.20 92.67,26.78 v1(91.17,25.28) ; v1(95.61,14.32) 96.79,14.32 C7.1 100.09,20.05 101.56,21.52 U1.35 ; R7.1 v1(91.19,21.18) ; v1(91.17,25.28) U1.23 ; v1(91.17,25.28) 90.88,24.99 90.26,24.99 ; v1(91.19,28.44) 91.17,28.45 C10.2 ; C9.1 109.59,33.24 ; 109.59,33.24 109.59,31.09 v1(108.31,29.81) ; 109.59,33.24 R1.2 ; U1.47 106.14,29.78 v1(106.17,29.81)
  Top Layer w0.381: 56.79,26.26 51.44,26.26 50.93,25.75 U3.9
  Top Layer w0.508: 100.88,45.69 100.85,45.71 ; 100.85,45.71 C4.1 ; 100.85,45.71 100.85,46.59 102.09,47.83 102.09,52.18 99.06,55.21 99.06,61.61 v1(102.87,65.42) ; C3.1 108.31,40.5 v1(109.6,39.21) 109.6,35.92 C9.1 ; v1(102.87,65.42) 104.39,66.95 v1(104.39,70.33) ; v1(102.87,65.42) 102.87,60.05 C1.1 ; C12.2 v2(56.79,31.69) ; U2.4 104.39,58.5 C1.1 ; C1.1 C2.1
  Top Layer w0.762: v2(108.97,54.07) 107.27,55.77 U2.4
  Bottom Layer w0.254: LED1.3 120.65,24.86 120.65,26.89 124.5,30.74 ; v1(88.72,9.95) 91.03,9.95 95.56,14.47 95.61,14.42 v1(95.61,14.32) ; v1(97.03,37.38) 98.86,39.21 v1(104.5,39.21) v1(109.6,39.21) ; v1(91.19,31.64) v1(91.19,28.44) 91.19,25.29 v1(91.17,25.28) 91.17,21.19 v1(91.19,21.18) ; v1(106.17,29.81) v1(108.31,29.81)
  Bottom Layer w0.381: CN3.3 v1(88.72,9.95) 91.19,12.41 v1(91.19,21.18) ; USB1.A1 USB1.B12 121.2,31.8 USB1.20
  Bottom Layer w0.508: 56.75,3.27 v2(56.77,3.29) CN1.3 56.79,7.49 v2(56.79,26.26) v2(56.79,31.69) ; 100.98,3.27 v2(100.97,3.28) CN4.3 ; v2(71.52,3.27) 71.5,3.29 CN2.3 ; v2(35.05,3.27) 35.05,3.28 LED5.1 LED5.3 ; USB1.B1 121.2,38.75 USB1.17 120.35,38.75 USB1.A12 ; LED3.3 LED3.1 ; 27.05,3.27 LED4.1 LED4.3 ; v2(43.05,3.27) LED6.1 LED6.3 ; CN3.3 v2(86.23,3.27)
  Bottom Layer w0.762: USB2.5 117.54,52.72 ; USB2.5 106.93,65.37 H1.3 ; USB2.5 112.07,54.76 111.31,54 109.04,54 v2(108.97,54.07) ; 117.54,52.72 USB2.6 117.54,42.4 USB1.17 USB1.18 USB1.19 ; 117.54,52.72 USB2.4 ; USB1.19 124.5,17.02 122.56,15.08 116.71,15.08 104.9,3.27 v2(86.23,3.27) v2(71.52,3.27) v2(43.05,3.27) v2(35.05,3.27) v2(27.05,3.27) 20.45,3.27 19.05,4.67 LED3.1 ; USB1.19 USB1.20 117.86,30.95 v1(109.6,39.21)
VCC1: length 9
  Bottom Layer w0.762: U4.2 23.42,66.57 20.95,64.1 K1.4
VCC2: length 8.1
  Bottom Layer w0.762: U5.2 45.5,68.58 K3.4
VCC3: length 8
  Bottom Layer w0.762: K5.4 67.58,68.31 U6.2
VCC4: length 8.1
  Bottom Layer w0.762: U7.2 89.66,68.55 K7.4
ACC1: length 6.8
  Bottom Layer w0.762: K2.4 28.5,65.55 U4.4
ACC2: length 6.9
  Bottom Layer w0.762: K4.4 50.58,65.66 U5.4
ACC3: length 6.7
  Bottom Layer w0.762: U6.4 72.66,65.26 K6.4
ACC4: length 6.8
  Bottom Layer w0.762: U7.4 94.74,65.5 K8.4
ACT_CFG: length 57.3
  Top Layer w0.254: v1(92.46,23.33) 91.92,22.8 81.05,22.8 H2.2 ; LED1.1 120.01,21.68 v1(105.28,21.68) ; v1(92.96,29.3) 93.44,29.78 U1.14 101.69,29.78 v1(101.73,29.81)
  Bottom Layer w0.254: v1(101.73,29.81) 103.63,29.81 104.78,28.67 104.78,22.19 v1(105.28,21.68) ; v1(92.46,23.33) 92.96,23.84 v1(92.96,29.3)
CTL_ACC1: length 53.4
  Top Layer w0.254: R10.2 22.64,18.42 33.53,29.3 40.26,29.3 42.04,31.08 U3.17
  Top Layer w0.381: K2.2 34.8,41.11 37.72,41.11 42.04,36.8 U3.17
CTL_ACC2: length 45.3
  Top Layer w0.254: R12.2 30.59,21.54 37.21,28.16 41.66,28.16 44.58,31.08 U3.15
  Top Layer w0.381: K4.2 50.8,47.08 50.8,43.27 44.58,37.05 U3.15
CTL_ACC3: length 61.8
  Top Layer w0.254: U3.13 47.12,31.08 43.05,27.02 40.39,27.02 38.48,25.11 38.48,15.37 R14.2
  Top Layer w0.381: K6.2 73.41,46.96 73.41,43.4 70.23,40.23 50.67,40.23 47.12,36.67 U3.13
CTL_ACC4: length 78.1
  Top Layer w0.254: 49.66,33.02 49.66,31.06 v1(49.63,31.03) ; R16.2 48.8,15.32 49.63,16.15 v1(49.63,16.2)
  Top Layer w0.381: 49.66,33.02 49.66,36.29 51.94,38.58 90.35,38.58 94.87,43.1 94.87,47.34 K8.2
  Bottom Layer w0.254: v1(49.63,31.03) v1(49.63,16.2)
CTL_VCC1: length 67.7
  Top Layer w0.254: R9.2 18.67,16.98 31.5,29.81 39.5,29.81 40.78,31.1 40.78,32.88
  Top Layer w0.381: K1.2 17.14,46.83 17.14,43.4 21.59,38.96 38.35,38.96 40.77,36.54 U3.18
CTL_VCC2: length 46.3
  Top Layer w0.254: 43.31,33.02 43.31,31.08 40.89,28.67 35.56,28.67 26.62,19.72 R11.2
  Top Layer w0.381: 43.31,33.02 43.31,38.58 38.86,43.02 38.86,46.7 K3.2
CTL_VCC3: length 50.7
  Top Layer w0.254: R13.2 34.56,23.23 38.99,27.65 42.42,27.65 45.85,31.08 U3.14
  Top Layer w0.381: K5.2 57.91,48.86 45.85,36.8 U3.14
CTL_VCC4: length 69.2
  Top Layer w0.254: U3.12 48.39,31.34 43.43,26.38 41.02,26.38 39.62,24.99 39.62,20.8 42.51,17.91 R15.2
  Top Layer w0.381: U3.12 48.39,36.29 51.56,39.46 70.87,39.46 80.26,48.86 K7.2
DTR0: length 72.8
  Top Layer w0.254: U1.39 102.14,25.78 100.97,24.61 96.39,24.61 94.11,22.32 v1(79.76,22.32) ; v1(78.61,16.98) 45.72,16.98 40.77,21.94 U3.1
  Bottom Layer w0.254: v1(79.76,22.32) 79.12,21.68 79.12,17.49 v1(78.61,16.98)
DTR1: length 55.9
  Top Layer w0.254: U1.18 93.35,27.78 91.39,29.74 47.68,29.74 43.31,25.37 43.31,23.81
DTR2: length 51.8
  Top Layer w0.254: U1.19 95.06,27.27 47.37,27.27 45.85,25.75 U3.5
DTR3: length 65.6
  Top Layer w0.254: v1(80.52,20.16) 49.66,20.16 48.39,21.43 U3.7 ; v1(81.79,14.06) 93.22,14.06 101.06,21.91 U1.34
  Bottom Layer w0.254: v1(80.52,20.16) 80.65,20.16 81.28,19.53 81.28,14.57 v1(81.79,14.06)
RESET: length 21.3
  Top Layer w0.254: R2.1 v1(86.06,35.15) ; v1(86.06,31.69) 87.54,31.69 C11.2 87.59,31.81 88.59,32.81 92.51,32.81 93.52,31.79 95.05,31.79 96.52,30.32 98.81,30.32 99.06,30.58 U1.7
  Bottom Layer w0.254: v1(86.06,31.69) 85.5,32.25 85.5,34.64 86,35.15 v1(86.06,35.15)
RTS0: length 82.3
  Top Layer w0.254: v1(101.6,26.26) 103.54,26.26 U1.40 ; v1(98.3,12.54) v1(81.53,12.54) ; U3.2 42.04,21.81 45.59,18.25 v1(79.88,18.25)
  Bottom Layer w0.254: v1(98.3,12.54) 99.57,12.54 101.22,14.19 101.22,25.88 v1(101.6,26.26) ; v1(81.53,12.54) 80.52,13.56 80.52,17.62 v1(79.88,18.25)
RTS1: length 61.5
  Top Layer w0.254: U1.11 97.06,33.08 96.27,33.88 v1(73.15,33.88) ; v1(71.37,28.42) 47.37,28.42 44.58,25.62 U3.4
  Bottom Layer w0.254: v1(73.15,33.88) 72.39,33.11 72.39,29.43 v1(71.37,28.42)
RTS2: length 56.4
  Top Layer w0.254: U1.27 97.56,21.58 95.25,19.27 49.28,19.27 47.12,21.43 U3.6
RTS3: length 78.2
  Top Layer w0.254: U1.45 101.2,28.78 v1(100.71,28.29) ; 49.66,23.81 49.66,21.81 50.42,21.05 H3.2 ; v1(83.19,13.3) v1(98.93,13.3)
  Bottom Layer w0.254: H3.2 82.69,13.79 v1(83.19,13.3) ; v1(98.93,13.3) 99.57,13.3 100.71,14.44 v1(100.71,28.29)
RX_LED: length 38.8
  Top Layer w0.254: v1(100.08,27.53) 99.57,28.03 98.55,28.03 97.81,28.78 U1.16 ; v1(100.08,14.95) 100.71,14.32 116.71,14.32 LED2.3
  Bottom Layer w0.254: v1(100.08,27.53) v1(100.08,14.95)
RXD0: length 46.1
  Top Layer w0.254: CN1.1 61.85,8.73 62.87,9.75 71.88,9.75 76.96,14.83 92.96,14.83 99.56,21.43 U1.31
RXD1: length 47.6
  Top Layer w0.254: v1(77.34,33.24) 96.27,33.24 96.56,32.94 U1.12
  Bottom Layer w0.254: CN2.1 75.44,8.6 75.44,31.34 v1(77.34,33.24)
RXD2: length 22.9
  Top Layer w0.254: U1.22 96.37,25.78 v1(96.77,25.37)
  Bottom Layer w0.254: v1(96.77,25.37) 96.77,11.4 92.84,7.46 CN3.1
RXD3: length 20
  Top Layer w0.254: U1.38 105.5,25.28 v1(106.04,24.73)
  Bottom Layer w0.254: v1(106.04,24.73) CN4.1
TEST: length 32.4
  Top Layer w0.254: v1(93.85,24.1) 92.33,24.1 91.44,23.21 83.19,23.21 H2.3 ; R1.1 107.46,29.32 106.41,28.28 U1.44 102.24,28.28 100.72,26.76 v1(98.55,26.76)
  Bottom Layer w0.254: v1(93.85,24.1) 96.52,26.76 v1(98.55,26.76)
TX_LED: length 43.3
  Top Layer w0.254: v1(99.44,28.67) 98.83,29.28 U1.15 ; LED2.1 120.4,15.46 118.75,15.46 116.84,13.56 99.95,13.56 v1(99.44,14.06)
  Bottom Layer w0.254: v1(99.44,14.06) v1(99.44,28.67)
TXD0: length 47.9
  Top Layer w0.254: CN1.2 59.31,8.85 61.21,10.76 71.25,10.76 76.2,15.72 92.84,15.72 99.06,21.94 U1.30
TXD1: length 43.7
  Top Layer w0.254: v1(74.73,30.47) 92.76,30.47 92.96,30.28 U1.13
  Bottom Layer w0.254: v1(74.73,30.47) 74.04,29.78 CN2.2
TXD2: length 29.1
  Top Layer w0.254: v1(97.54,25.75) 97.01,26.28 U1.21
  Bottom Layer w0.254: CN3.2 90.29,5.94 92.71,5.94 97.54,10.76 v1(97.54,25.75)
TXD3: length 17.3
  Top Layer w0.254: U1.37 103.56,23.39 v1(103.5,23.33)
  Bottom Layer w0.254: CN4.2 103.5,23.33 v1(103.5,23.33)
UD+: length 35.4
  Top Layer w0.254: USB1.B6 120.95,35.7 120.1,34.85 USB1.A6 ; U1.43 108.61,27.78 116.38,35.55 v1(117.3,35.55)
  Bottom Layer w0.254: v1(114.83,47.47) 114.83,36.29 115.57,35.55 v1(117.3,35.55) 118,34.85 USB1.A6
UD-: length 35.6
  Top Layer w0.254: v1(118.51,35.7) 118.51,35.71 112.83,41.39 USB2.2 ; v1(118.51,35.7) 110.09,27.28 U1.42 ; v1(118.51,35.7) USB1.A7
  Bottom Layer w0.254: USB1.B7 120.95,34.85 120.1,35.7 USB1.A7
XI: length 10.1
  Top Layer w0.254: U1.5 100.06,33.36 101.74,35.03 C5.2 101.85,36.02 101.85,37.56 103.03,38.74 X1.1
XO: length 9.4
  Top Layer w0.254: U1.6 99.56,33.5 99.04,34.02 C6.2 99.04,37.83 98.13,38.74 X1.2
$1N13413: length 4.8
  Top Layer w0.254: R3.1 119.13,26.38 LED1.4
$1N13442: length 8.5
  Top Layer w0.254: LED1.2 120.65,24.86 118.36,24.86 116.54,23.04 R4.1
$1N14121: length 4.8
  Top Layer w0.254: LED2.4 119.21,19.69 R5.1
$1N14153: length 8.6
  Top Layer w0.254: LED2.2 120.65,18.25 118.75,18.25 116.84,16.35 R6.1
$1N14923: length 4
  Top Layer w0.254: H2.1 76.34,23.99 R8.1
$1N15051: length 2.9
  Top Layer w0.254: H3.1 87.39,21.05 R7.2
$1N34229: length 5.9
  Top Layer w0.254: R9.1 18.67,11.52 LED3.4
$1N34270: length 8.4
  Top Layer w0.254: LED3.2 21.84,6.06 23.37,7.59 23.37,11.02 22.64,11.74 R10.1
$1N34311: length 5.9
  Top Layer w0.254: LED4.4 26.62,11.58 R11.1
$1N34352: length 8.4
  Top Layer w0.254: LED4.2 29.84,6.06 31.24,7.46 31.24,11.02 30.59,11.67 R12.1
$1N34393: length 6
  Top Layer w0.254: LED5.4 34.56,11.63 R13.1
$1N34434: length 8.3
  Top Layer w0.254: LED5.2 37.97,6.06 39.12,7.21 39.12,10.38 38.54,10.96 R14.1
$1N34475: length 6
  Top Layer w0.254: R15.1 42.51,11.69 LED6.4
$1N34516: length 8.1
  Top Layer w0.254: LED6.2 47.12,7.59 47.12,11.27 46.48,11.91 R16.1

## Copper pours and planes (outline as drawn; the poured copper is in the pictures)
GND on Top Layer: 0.88,69.57 0.89,69.88 0.95,70.22 1.04,70.56 1.17,70.88 1.34,71.18 1.54,71.47 1.77,71.73 2.03,71.96 2.32,72.16 2.62,72.33 2.94,72.46 3.28,72.55 3.62,72.61 3.93,72.62 124.16,72.62 124.46,72.61 124.8,72.55 125.14,72.46 125.46,72.33 125.77,72.16 126.05,71.96 126.31,71.73 126.54,71.47 126.74,71.18 126.91,70.88 127.04,70.56 127.13,70.22 127.19,69.88 127.2,69.57 127.2,4.06 127.19,3.75 127.13,3.41 127.04,3.07 126.91,2.75 126.74,2.44 126.54,2.16 126.31,1.9 126.05,1.67 125.77,1.47 125.46,1.3 125.14,1.17 124.8,1.08 124.46,1.02 124.16,1.01 3.93,1.01 3.62,1.02 3.28,1.08 2.94,1.17 2.62,1.3 2.32,1.47 2.03,1.67 1.77,1.9 1.54,2.16 1.34,2.44 1.17,2.75 1.04,3.07 0.95,3.41 0.89,3.75 0.88,4.06
GND on Bottom Layer: 0.88,69.57 0.89,69.88 0.95,70.22 1.04,70.56 1.17,70.88 1.34,71.18 1.54,71.47 1.77,71.73 2.03,71.96 2.32,72.16 2.62,72.33 2.94,72.46 3.28,72.55 3.62,72.61 3.93,72.62 124.07,72.62 124.38,72.61 124.72,72.55 125.06,72.46 125.38,72.33 125.68,72.16 125.97,71.96 126.23,71.73 126.46,71.47 126.66,71.18 126.83,70.88 126.96,70.56 127.05,70.22 127.11,69.88 127.12,69.57 127.12,3.93 127.11,3.62 127.05,3.28 126.96,2.94 126.83,2.62 126.66,2.32 126.46,2.03 126.23,1.77 125.97,1.54 125.68,1.34 125.38,1.17 125.06,1.04 124.72,0.95 124.38,0.89 124.07,0.88 3.93,0.88 3.62,0.89 3.28,0.95 2.94,1.04 2.62,1.17 2.32,1.34 2.03,1.54 1.77,1.77 1.54,2.03 1.34,2.32 1.17,2.62 1.04,2.94 0.95,3.28 0.89,3.62 0.88,3.93

Small or netless copper shapes (teardrops, artwork), in the pictures only: 266 on Top Layer, 174 on Bottom Layer

## Text on the board
Top Silkscreen Layer: V0.0.1 | 2022-11-21 | 24V | VCC | ACC | VCC1 | ACC1 | ACC2 | VCC2 | VCC3 | ACC3 | VCC4 | ACC4 | GND | TX | RX | CFG | TEST | RTS3 | 3V3 | 5V | PWR
